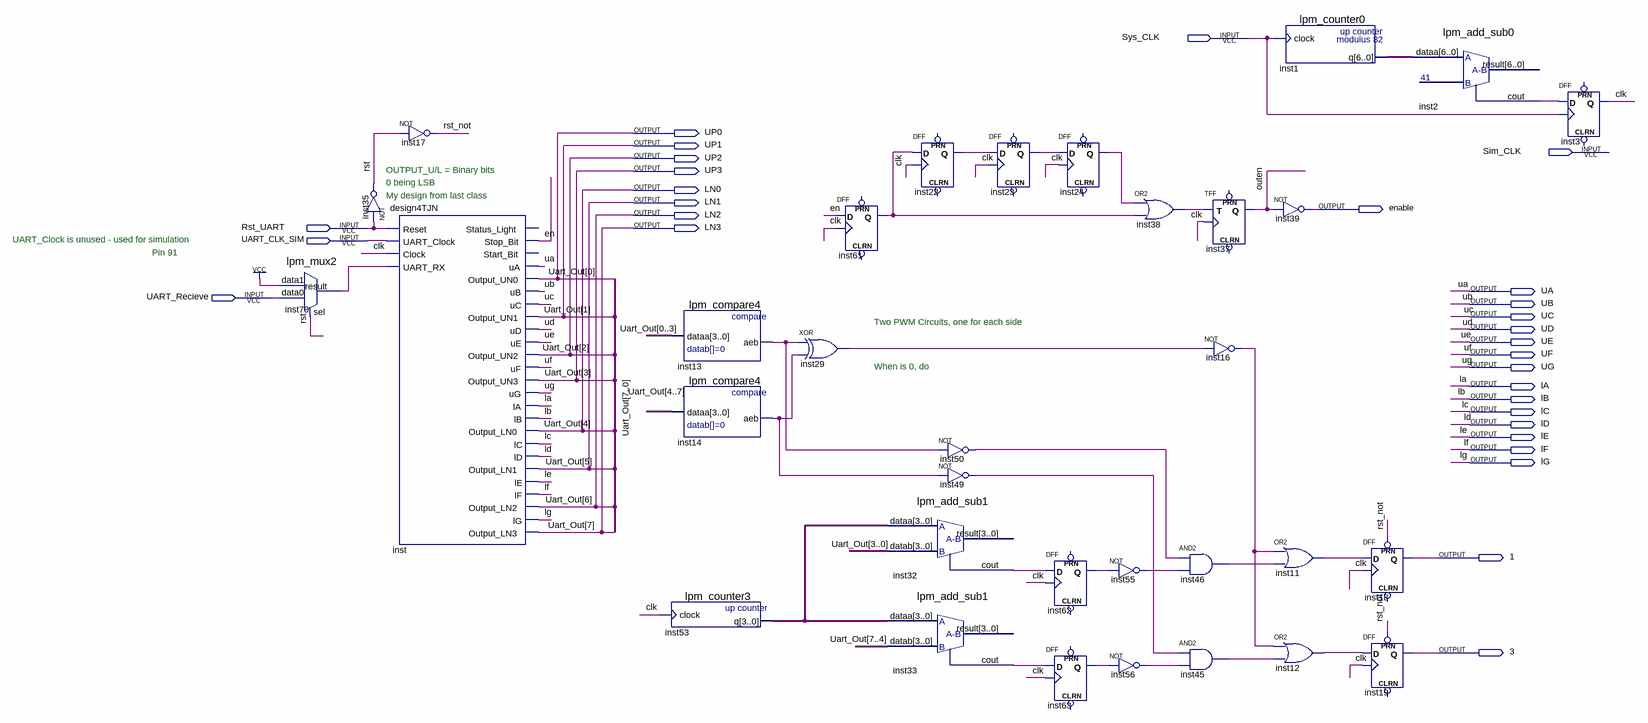
[diagram p0: schematic sheet]
// Quartus schematic project6.bdf as structural Verilog: 33 symbols, 30 pins
module project6 (
  input  Sys_CLK,
  input  Sim_CLK,
  input  Rst_UART,
  input  UART_CLK_SIM,
  input  UART_Recieve,
  output UP0,
  output UP1,
  output UP2,
  output UP3,
  output LN0,
  output LN1,
  output enable,
  output LN2,
  output LN3,
  output UA,
  output UB,
  output UC,
  output UD,
  output UE,
  output UF,
  output UG,
  output lA,
  output lB,
  output lC,
  output lD,
  output lE,
  output lF,
  output lG,
  output \1 ,
  output \3 
);

  wire clk, en, inst2_cout, inst11_out, inst12_out, inst13_aeb, inst14_aeb, inst16_out, inst22_q, inst23_q,
       inst24_q, inst29_out, inst32_cout, inst33_cout, inst38_out, inst45_out, inst46_out, inst49_out,
       inst50_out, inst55_out, inst56_out, inst61_q, inst62_q, inst63_q, inst70_result, outen, rst, rst_not;
  wire [3:0] inst53_q;
  wire [6:0] inst1_q;

  lpm_mux2 inst70 (.data1(1'b1), .data0(UART_Recieve), .sel(rst), .result(inst70_result));
  not inst35 (rst, Rst_UART);
  design4TJN inst (
    .Reset(Rst_UART), .UART_Clock(UART_CLK_SIM), .Clock(clk), .UART_RX(inst70_result), .Stop_Bit(en),
    .uA(UA), .Output_UN0(UP0), .uB(UB), .uC(UC), .Output_UN1(UP1), .uD(UD), .uE(UE), .Output_UN2(UP2),
    .uF(UF), .Output_UN3(UP3), .uG(UG), .lA(lA), .lB(lB), .Output_LN0(LN0), .lC(lC), .lD(lD),
    .Output_LN1(LN1), .lE(lE), .lF(lF), .Output_LN2(LN2), .lG(lG), .Output_LN3(LN3));  // open: Status_Light, Start_Bit
  not inst17 (rst_not, rst);
  lpm_compare4 inst13 (.dataa({UP0, UP1, UP2, UP3}), .aeb(inst13_aeb));
  lpm_compare4 inst14 (.dataa({LN0, LN1, LN2, LN3}), .aeb(inst14_aeb));
  lpm_counter3 inst53 (.clock(clk), .q(inst53_q));
  xor inst29 (inst29_out, inst13_aeb, inst14_aeb);
  DFF inst61 (.CLK(clk), .D(en), .Q(inst61_q));  // open: CLRN, PRN
  lpm_add_sub1 inst32 (.dataa(inst53_q), .datab({UP3, UP2, UP1, UP0}), .cout(inst32_cout));  // open: result
  lpm_add_sub1 inst33 (.dataa(inst53_q), .datab({LN3, LN2, LN1, LN0}), .cout(inst33_cout));  // open: result
  DFF inst22 (.CLK(clk), .D(inst61_q), .Q(inst22_q));  // open: CLRN, PRN
  not inst50 (inst50_out, inst13_aeb);
  not inst49 (inst49_out, inst14_aeb);
  DFF inst23 (.CLK(clk), .D(inst22_q), .Q(inst23_q));  // open: CLRN, PRN
  DFF inst62 (.CLK(clk), .D(inst32_cout), .Q(inst62_q));  // open: CLRN, PRN
  DFF inst63 (.CLK(clk), .D(inst33_cout), .Q(inst63_q));  // open: CLRN, PRN
  DFF inst24 (.CLK(clk), .D(inst23_q), .Q(inst24_q));  // open: CLRN, PRN
  or inst38 (inst38_out, inst24_q, inst61_q);
  not inst55 (inst55_out, inst62_q);
  not inst56 (inst56_out, inst63_q);
  TFF inst37 (.T(inst38_out), .CLK(clk), .Q(outen));  // open: PRN, CLRN
  not inst16 (inst16_out, inst29_out);
  and inst46 (inst46_out, inst50_out, inst55_out);
  and inst45 (inst45_out, inst49_out, inst56_out);
  lpm_counter0 inst1 (.clock(Sys_CLK), .q(inst1_q));
  not inst39 (enable, outen);
  or inst11 (inst11_out, inst16_out, inst46_out);
  or inst12 (inst12_out, inst16_out, inst45_out);
  DFF inst18 (.CLK(clk), .D(inst11_out), .PRN(rst_not), .Q(\1 ));  // open: CLRN
  DFF inst19 (.CLK(clk), .D(inst12_out), .PRN(rst_not), .Q(\3 ));  // open: CLRN
  lpm_add_sub0 inst2 (.dataa(inst1_q), .cout(inst2_cout));  // open: result
  DFF inst3 (.CLK(Sys_CLK), .D(inst2_cout), .Q(clk));  // open: CLRN, PRN

  // Other names for the same wires on the sheet: Uart_Out[7:0] = {LN3, LN2, LN1, LN0, UP3, UP2, UP1, UP0}

  // Notes on the sheet:
  //   OUTPUT_U/L = Binary bits
  //   0 being LSB
  //   My design from last class
  //   UART_Clock is unused - used for simulation
  //   Pin 91
  //   Two PWM Circuits, one for each side
  //   When is 0, do
endmodule
